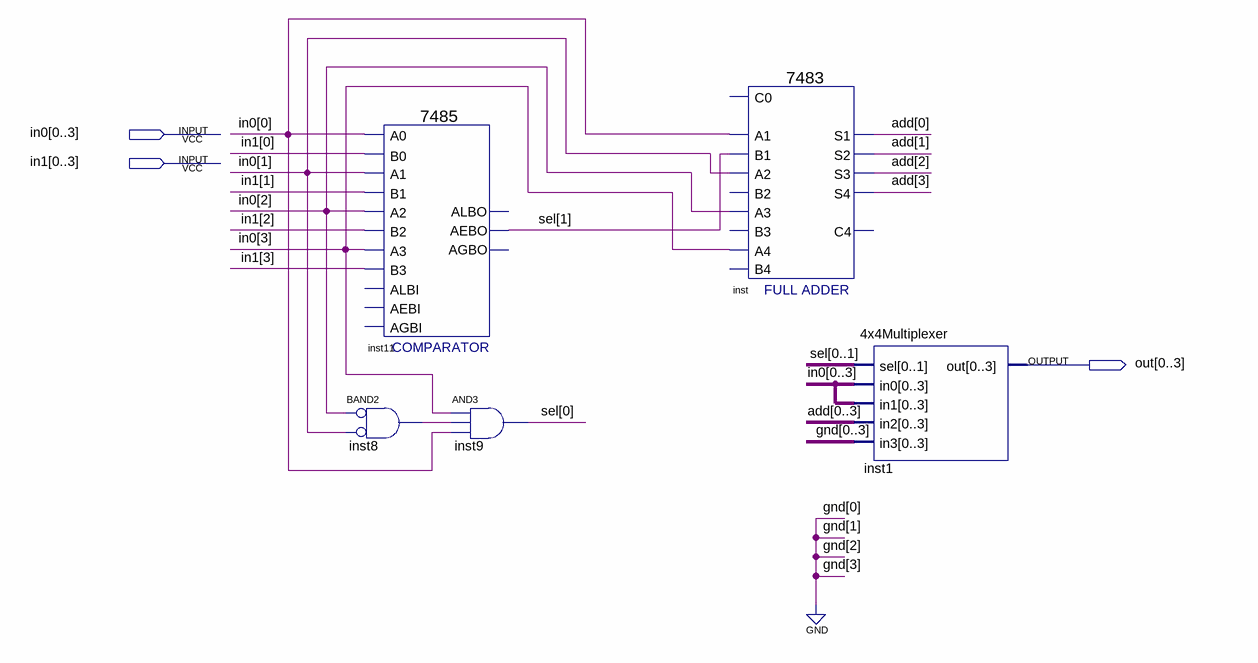
[diagram p0: schematic sheet]
// Quartus schematic RandomNumberValidator.bdf as structural Verilog: 5 symbols, 3 pins
module RandomNumberValidator (
  input  [0:3] in0,
  input  [0:3] in1,
  output [0:3] out
);

  wire inst8_out;
  wire [1:0] sel;
  wire [3:0] add;

  \7485  inst11 (
    .A3(in0[3]), .B2(in1[2]), .A2(in0[2]), .A0(in0[0]), .B0(in1[0]), .B3(in1[3]), .A1(in0[1]), .B1(in1[1]),
    .AEBO(sel[1]));  // open: AEBI, AGBI, ALBI, ALBO, AGBO
  and inst8 (inst8_out, ~in0[2], ~in0[1]);  // BAND2
  and inst9 (sel[0], in0[3], inst8_out, in0[0]);
  \7483  inst (
    .A1(in0[0]), .A2(in0[1]), .B1(sel[1]), .A3(in0[2]), .A4(in0[3]), .S3(add[2]), .S4(add[3]), .S2(add[1]),
    .S1(add[0]));  // open: B4, C0, B2, B3, C4
  \4x4Multiplexer  inst1 (
    .sel({sel[0], sel[1]}), .in0(in0), .in1(in0), .in2({add[0], add[1], add[2], add[3]}), .in3(4'b0000),
    .out(out));
endmodule
